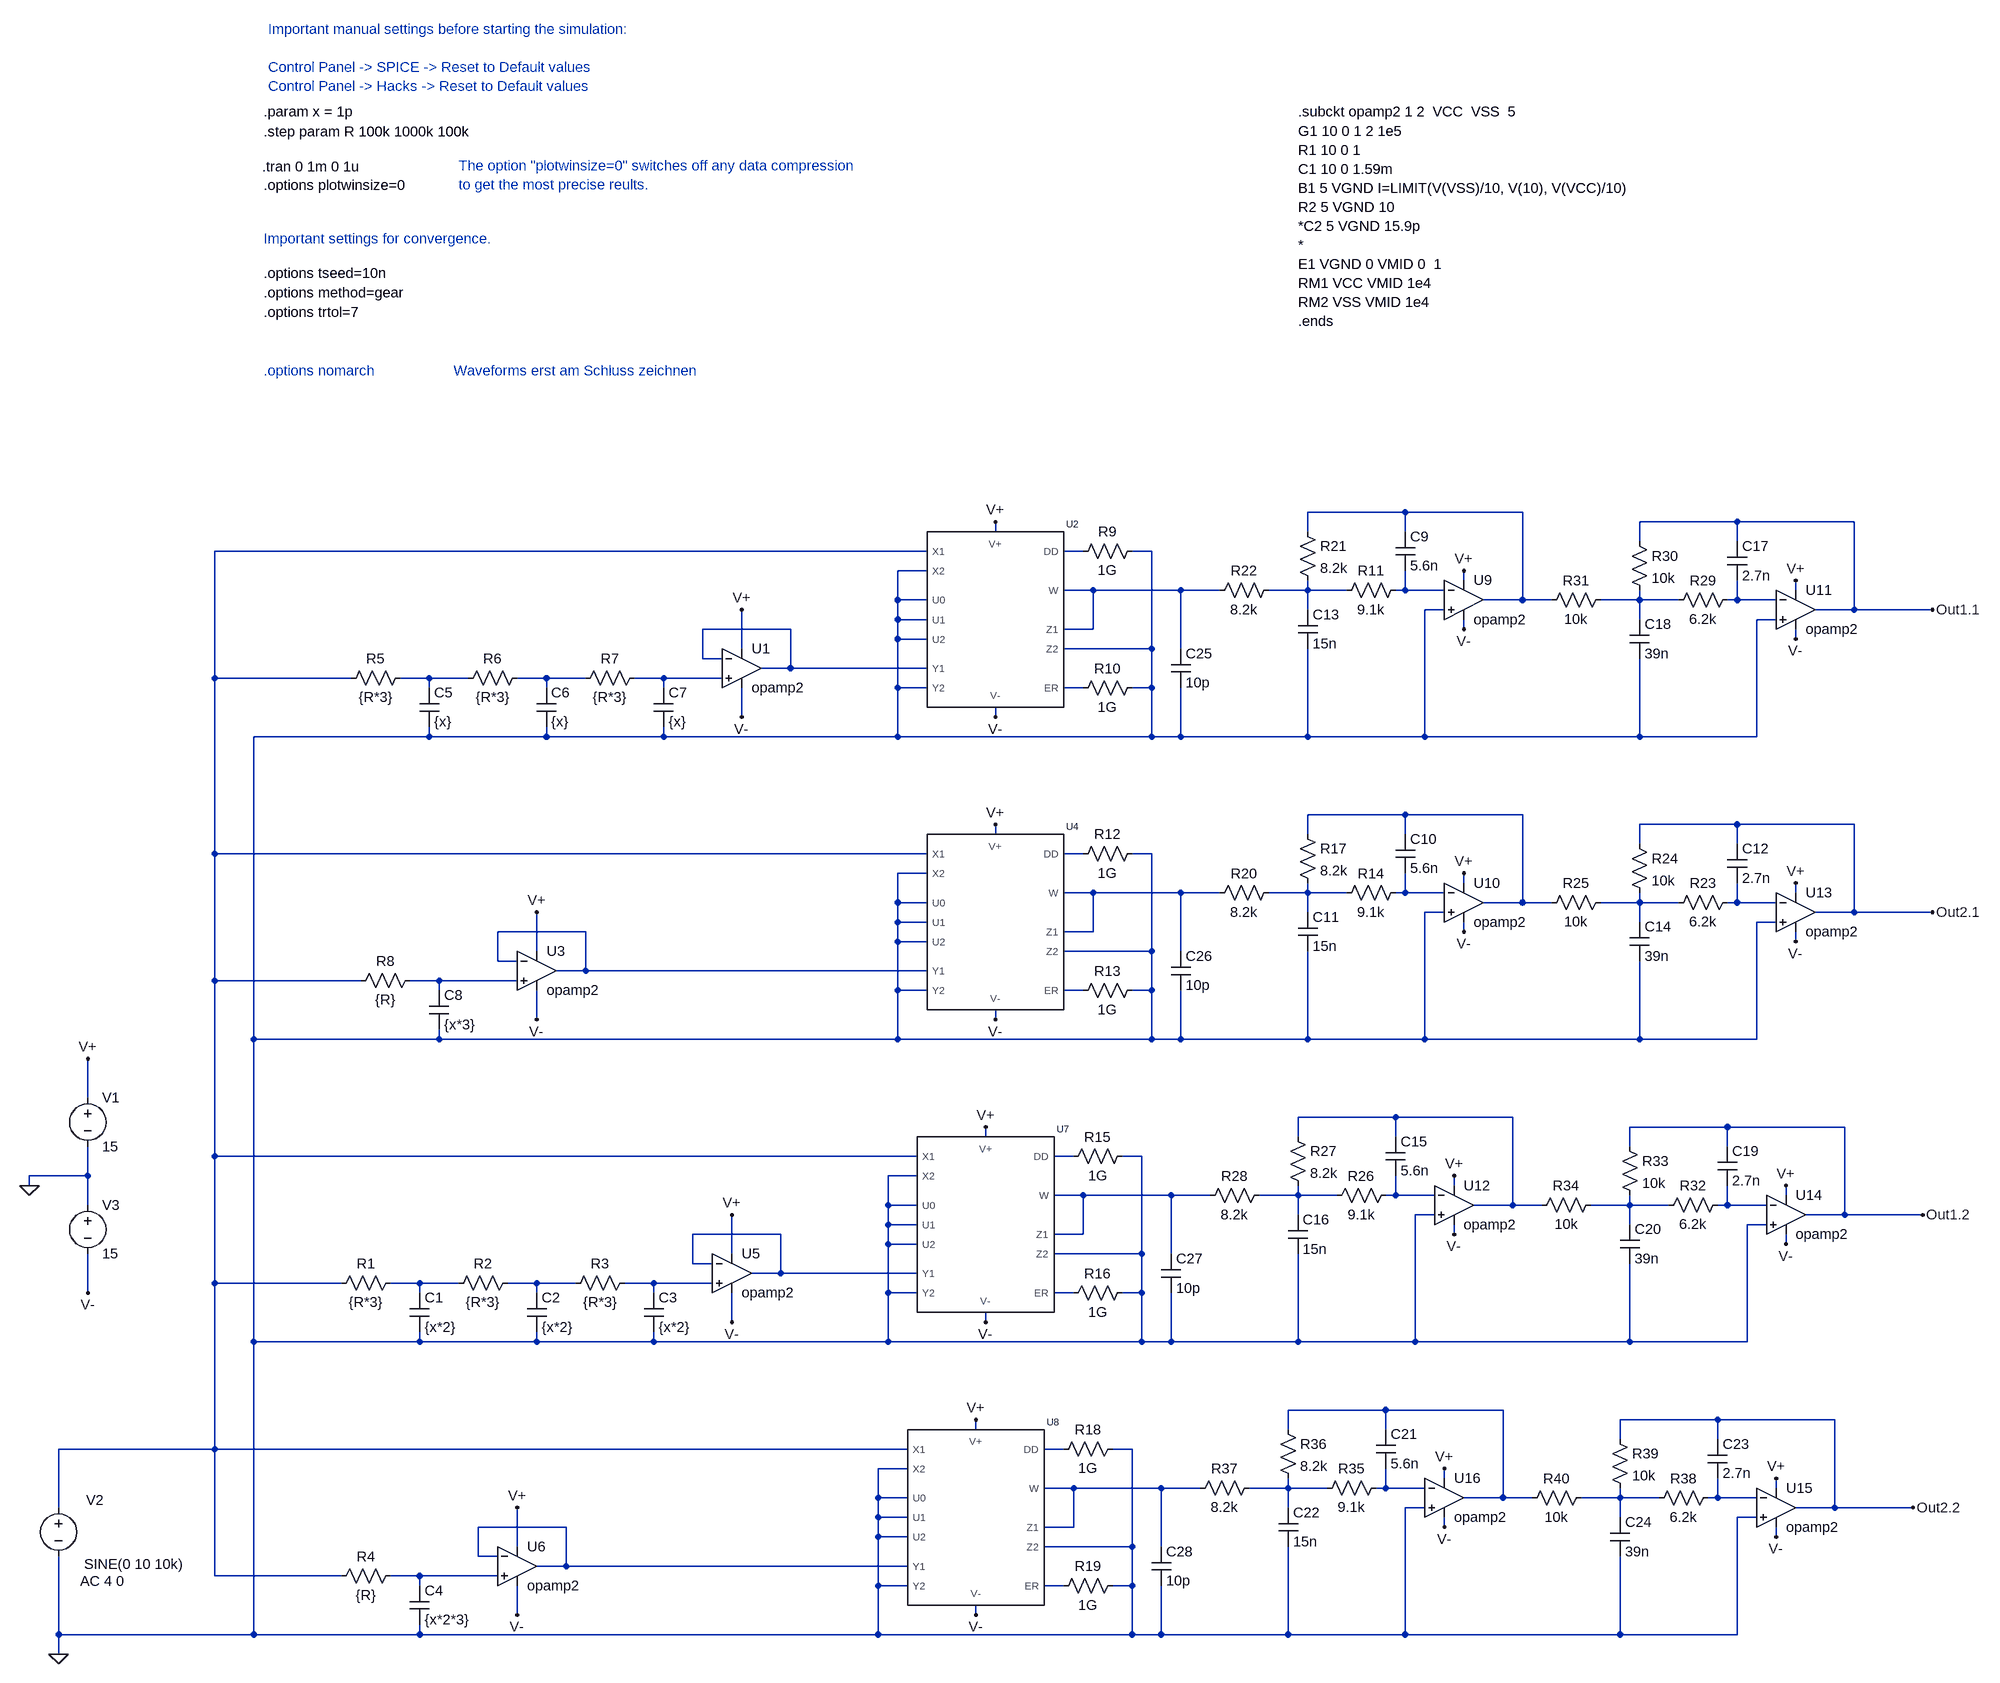
[diagram p0: schematic voll_leer_Kanal7_2.asc]
voll_leer_Kanal7_2.asc, the LTspice schematic file:
Version 4
SHEET 1 4732 680
WIRE -368 -176 -368 -192
WIRE -320 352 -320 256
WIRE -320 560 -320 432
WIRE -320 592 -320 560
WIRE -272 -320 -272 -384
WIRE -272 -192 -368 -192
WIRE -272 -192 -272 -240
WIRE -272 -144 -272 -192
WIRE -272 0 -272 -64
WIRE -64 -1008 -64 -1216
WIRE -64 -720 -64 -1008
WIRE -64 -512 -64 -720
WIRE -64 -224 -64 -512
WIRE -64 -16 -64 -224
WIRE -64 256 -320 256
WIRE -64 256 -64 -16
WIRE -64 464 -64 256
WIRE 0 -416 0 -912
WIRE 0 80 0 -416
WIRE 0 560 -320 560
WIRE 0 560 0 80
WIRE 144 -16 -64 -16
WIRE 144 464 -64 464
WIRE 160 -1008 -64 -1008
WIRE 176 -512 -64 -512
WIRE 272 -16 224 -16
WIRE 272 0 272 -16
WIRE 272 80 0 80
WIRE 272 80 272 64
WIRE 272 464 224 464
WIRE 272 480 272 464
WIRE 272 560 0 560
WIRE 272 560 272 544
WIRE 288 -1008 240 -1008
WIRE 288 -992 288 -1008
WIRE 288 -912 0 -912
WIRE 288 -912 288 -928
WIRE 304 -512 256 -512
WIRE 304 -496 304 -512
WIRE 304 -416 0 -416
WIRE 304 -416 304 -432
WIRE 336 -16 272 -16
WIRE 352 -1008 288 -1008
WIRE 368 432 368 384
WIRE 400 -544 400 -592
WIRE 400 432 368 432
WIRE 400 464 272 464
WIRE 432 -544 400 -544
WIRE 432 -512 304 -512
WIRE 432 416 432 352
WIRE 432 528 432 480
WIRE 464 -560 464 -624
WIRE 464 -448 464 -496
WIRE 464 -16 416 -16
WIRE 464 0 464 -16
WIRE 464 80 272 80
WIRE 464 80 464 64
WIRE 480 -1008 432 -1008
WIRE 480 -992 480 -1008
WIRE 480 -912 288 -912
WIRE 480 -912 480 -928
WIRE 512 384 368 384
WIRE 512 448 464 448
WIRE 512 448 512 384
WIRE 528 -16 464 -16
WIRE 544 -1008 480 -1008
WIRE 544 -592 400 -592
WIRE 544 -528 496 -528
WIRE 544 -528 544 -592
WIRE 656 -16 608 -16
WIRE 656 0 656 -16
WIRE 656 80 464 80
WIRE 656 80 656 64
WIRE 672 -1008 624 -1008
WIRE 672 -992 672 -1008
WIRE 672 -912 480 -912
WIRE 672 -912 672 -928
WIRE 720 -48 720 -96
WIRE 736 -1040 736 -1088
WIRE 752 -48 720 -48
WIRE 752 -16 656 -16
WIRE 768 -1040 736 -1040
WIRE 768 -1008 672 -1008
WIRE 784 -64 784 -128
WIRE 784 48 784 0
WIRE 800 -1056 800 -1120
WIRE 800 -944 800 -992
WIRE 864 -96 720 -96
WIRE 864 -32 816 -32
WIRE 864 -32 864 -96
WIRE 880 -1088 736 -1088
WIRE 880 -1024 832 -1024
WIRE 880 -1024 880 -1088
WIRE 1024 336 1024 288
WIRE 1024 368 1024 336
WIRE 1024 400 1024 368
WIRE 1024 480 1024 400
WIRE 1024 560 272 560
WIRE 1024 560 1024 480
WIRE 1040 -144 1040 -192
WIRE 1040 -112 1040 -144
WIRE 1040 -80 1040 -112
WIRE 1040 0 1040 -80
WIRE 1040 80 656 80
WIRE 1040 80 1040 0
WIRE 1056 -1136 1056 -1184
WIRE 1056 -1104 1056 -1136
WIRE 1056 -1072 1056 -1104
WIRE 1056 -992 1056 -1072
WIRE 1056 -912 672 -912
WIRE 1056 -912 1056 -992
WIRE 1056 -640 1056 -688
WIRE 1056 -608 1056 -640
WIRE 1056 -576 1056 -608
WIRE 1056 -496 1056 -576
WIRE 1056 -416 304 -416
WIRE 1056 -416 1056 -496
WIRE 1072 256 -64 256
WIRE 1072 288 1024 288
WIRE 1072 336 1024 336
WIRE 1072 368 1024 368
WIRE 1072 400 1024 400
WIRE 1072 448 512 448
WIRE 1072 480 1024 480
WIRE 1088 -224 -64 -224
WIRE 1088 -192 1040 -192
WIRE 1088 -144 1040 -144
WIRE 1088 -112 1040 -112
WIRE 1088 -80 1040 -80
WIRE 1088 -32 864 -32
WIRE 1088 0 1040 0
WIRE 1104 -1216 -64 -1216
WIRE 1104 -1184 1056 -1184
WIRE 1104 -1136 1056 -1136
WIRE 1104 -1104 1056 -1104
WIRE 1104 -1072 1056 -1072
WIRE 1104 -1024 880 -1024
WIRE 1104 -992 1056 -992
WIRE 1104 -720 -64 -720
WIRE 1104 -688 1056 -688
WIRE 1104 -640 1056 -640
WIRE 1104 -608 1056 -608
WIRE 1104 -576 1056 -576
WIRE 1104 -528 544 -528
WIRE 1104 -496 1056 -496
WIRE 1184 224 1184 208
WIRE 1184 528 1184 512
WIRE 1200 -256 1200 -272
WIRE 1200 48 1200 32
WIRE 1216 -1248 1216 -1264
WIRE 1216 -944 1216 -960
WIRE 1216 -752 1216 -768
WIRE 1216 -448 1216 -464
WIRE 1328 256 1296 256
WIRE 1328 480 1296 480
WIRE 1344 -224 1312 -224
WIRE 1344 0 1312 0
WIRE 1344 320 1296 320
WIRE 1344 384 1296 384
WIRE 1344 384 1344 320
WIRE 1360 -1216 1328 -1216
WIRE 1360 -992 1328 -992
WIRE 1360 -720 1328 -720
WIRE 1360 -496 1328 -496
WIRE 1360 -160 1312 -160
WIRE 1360 -96 1312 -96
WIRE 1360 -96 1360 -160
WIRE 1376 -1152 1328 -1152
WIRE 1376 -1088 1328 -1088
WIRE 1376 -1088 1376 -1152
WIRE 1376 -656 1328 -656
WIRE 1376 -592 1328 -592
WIRE 1376 -592 1376 -656
WIRE 1440 256 1408 256
WIRE 1440 416 1296 416
WIRE 1440 416 1440 256
WIRE 1440 480 1408 480
WIRE 1440 480 1440 416
WIRE 1440 560 1024 560
WIRE 1440 560 1440 480
WIRE 1456 -224 1424 -224
WIRE 1456 -64 1312 -64
WIRE 1456 -64 1456 -224
WIRE 1456 0 1424 0
WIRE 1456 0 1456 -64
WIRE 1456 80 1040 80
WIRE 1456 80 1456 0
WIRE 1472 -1216 1440 -1216
WIRE 1472 -1056 1328 -1056
WIRE 1472 -1056 1472 -1216
WIRE 1472 -992 1440 -992
WIRE 1472 -992 1472 -1056
WIRE 1472 -912 1056 -912
WIRE 1472 -912 1472 -992
WIRE 1472 -720 1440 -720
WIRE 1472 -560 1328 -560
WIRE 1472 -560 1472 -720
WIRE 1472 -496 1440 -496
WIRE 1472 -496 1472 -560
WIRE 1472 -416 1056 -416
WIRE 1472 -416 1472 -496
WIRE 1488 320 1344 320
WIRE 1488 416 1488 320
WIRE 1488 560 1440 560
WIRE 1488 560 1488 480
WIRE 1504 -160 1360 -160
WIRE 1504 -64 1504 -160
WIRE 1504 80 1456 80
WIRE 1504 80 1504 0
WIRE 1520 -1152 1376 -1152
WIRE 1520 -1056 1520 -1152
WIRE 1520 -912 1472 -912
WIRE 1520 -912 1520 -992
WIRE 1520 -656 1376 -656
WIRE 1520 -560 1520 -656
WIRE 1520 -416 1472 -416
WIRE 1520 -416 1520 -496
WIRE 1552 320 1488 320
WIRE 1568 -160 1504 -160
WIRE 1584 -1152 1520 -1152
WIRE 1584 -656 1520 -656
WIRE 1696 224 1696 192
WIRE 1696 320 1632 320
WIRE 1696 320 1696 304
WIRE 1696 352 1696 320
WIRE 1696 560 1488 560
WIRE 1696 560 1696 416
WIRE 1712 -256 1712 -288
WIRE 1712 -160 1648 -160
WIRE 1712 -160 1712 -176
WIRE 1712 -128 1712 -160
WIRE 1712 80 1504 80
WIRE 1712 80 1712 -64
WIRE 1728 -1248 1728 -1280
WIRE 1728 -1152 1664 -1152
WIRE 1728 -1152 1728 -1168
WIRE 1728 -1120 1728 -1152
WIRE 1728 -912 1520 -912
WIRE 1728 -912 1728 -1056
WIRE 1728 -752 1728 -784
WIRE 1728 -656 1664 -656
WIRE 1728 -656 1728 -672
WIRE 1728 -624 1728 -656
WIRE 1728 -416 1520 -416
WIRE 1728 -416 1728 -560
WIRE 1760 320 1696 320
WIRE 1776 -160 1712 -160
WIRE 1792 -1152 1728 -1152
WIRE 1792 -656 1728 -656
WIRE 1856 192 1696 192
WIRE 1856 224 1856 192
WIRE 1856 320 1840 320
WIRE 1856 320 1856 288
WIRE 1872 -288 1712 -288
WIRE 1872 -256 1872 -288
WIRE 1872 -160 1856 -160
WIRE 1872 -160 1872 -192
WIRE 1888 -1280 1728 -1280
WIRE 1888 -1248 1888 -1280
WIRE 1888 -1152 1872 -1152
WIRE 1888 -1152 1888 -1184
WIRE 1888 -784 1728 -784
WIRE 1888 -752 1888 -784
WIRE 1888 -656 1872 -656
WIRE 1888 -656 1888 -688
WIRE 1888 560 1696 560
WIRE 1888 560 1888 352
WIRE 1904 80 1712 80
WIRE 1904 80 1904 -128
WIRE 1920 -912 1728 -912
WIRE 1920 -912 1920 -1120
WIRE 1920 -416 1728 -416
WIRE 1920 -416 1920 -624
WIRE 1920 320 1856 320
WIRE 1920 352 1888 352
WIRE 1936 -160 1872 -160
WIRE 1936 -128 1904 -128
WIRE 1952 -1152 1888 -1152
WIRE 1952 -1120 1920 -1120
WIRE 1952 -656 1888 -656
WIRE 1952 -624 1920 -624
WIRE 1952 304 1952 288
WIRE 1952 384 1952 368
WIRE 1968 -176 1968 -192
WIRE 1968 -96 1968 -112
WIRE 1984 -1168 1984 -1184
WIRE 1984 -1088 1984 -1104
WIRE 1984 -672 1984 -688
WIRE 1984 -592 1984 -608
WIRE 2048 192 1856 192
WIRE 2048 336 1984 336
WIRE 2048 336 2048 192
WIRE 2064 -288 1872 -288
WIRE 2064 -144 2000 -144
WIRE 2064 -144 2064 -288
WIRE 2080 -1280 1888 -1280
WIRE 2080 -1136 2016 -1136
WIRE 2080 -1136 2080 -1280
WIRE 2080 -784 1888 -784
WIRE 2080 -640 2016 -640
WIRE 2080 -640 2080 -784
WIRE 2096 336 2048 336
WIRE 2112 -144 2064 -144
WIRE 2128 -1136 2080 -1136
WIRE 2128 -640 2080 -640
WIRE 2240 240 2240 208
WIRE 2240 336 2176 336
WIRE 2240 336 2240 320
WIRE 2240 368 2240 336
WIRE 2240 560 1888 560
WIRE 2240 560 2240 432
WIRE 2256 -240 2256 -272
WIRE 2256 -144 2192 -144
WIRE 2256 -144 2256 -160
WIRE 2256 -112 2256 -144
WIRE 2256 80 1904 80
WIRE 2256 80 2256 -48
WIRE 2272 -1232 2272 -1264
WIRE 2272 -1136 2208 -1136
WIRE 2272 -1136 2272 -1152
WIRE 2272 -1104 2272 -1136
WIRE 2272 -912 1920 -912
WIRE 2272 -912 2272 -1040
WIRE 2272 -736 2272 -768
WIRE 2272 -640 2208 -640
WIRE 2272 -640 2272 -656
WIRE 2272 -608 2272 -640
WIRE 2272 -416 1920 -416
WIRE 2272 -416 2272 -544
WIRE 2304 336 2240 336
WIRE 2320 -144 2256 -144
WIRE 2336 -1136 2272 -1136
WIRE 2336 -640 2272 -640
WIRE 2400 208 2240 208
WIRE 2400 240 2400 208
WIRE 2400 336 2384 336
WIRE 2400 336 2400 304
WIRE 2416 -272 2256 -272
WIRE 2416 -240 2416 -272
WIRE 2416 -144 2400 -144
WIRE 2416 -144 2416 -176
WIRE 2432 -1264 2272 -1264
WIRE 2432 -1232 2432 -1264
WIRE 2432 -1136 2416 -1136
WIRE 2432 -1136 2432 -1168
WIRE 2432 -768 2272 -768
WIRE 2432 -736 2432 -768
WIRE 2432 -640 2416 -640
WIRE 2432 -640 2432 -672
WIRE 2432 560 2240 560
WIRE 2432 560 2432 368
WIRE 2448 80 2256 80
WIRE 2448 80 2448 -112
WIRE 2464 -912 2272 -912
WIRE 2464 -912 2464 -1104
WIRE 2464 -416 2272 -416
WIRE 2464 -416 2464 -608
WIRE 2464 336 2400 336
WIRE 2464 368 2432 368
WIRE 2480 -144 2416 -144
WIRE 2480 -112 2448 -112
WIRE 2496 -1136 2432 -1136
WIRE 2496 -1104 2464 -1104
WIRE 2496 -640 2432 -640
WIRE 2496 -608 2464 -608
WIRE 2496 320 2496 304
WIRE 2496 400 2496 384
WIRE 2512 -160 2512 -176
WIRE 2512 -80 2512 -96
WIRE 2528 -1152 2528 -1168
WIRE 2528 -1072 2528 -1088
WIRE 2528 -656 2528 -672
WIRE 2528 -576 2528 -592
WIRE 2592 208 2400 208
WIRE 2592 352 2528 352
WIRE 2592 352 2592 208
WIRE 2608 -272 2416 -272
WIRE 2608 -128 2544 -128
WIRE 2608 -128 2608 -272
WIRE 2624 -1264 2432 -1264
WIRE 2624 -1120 2560 -1120
WIRE 2624 -1120 2624 -1264
WIRE 2624 -768 2432 -768
WIRE 2624 -624 2560 -624
WIRE 2624 -624 2624 -768
WIRE 2720 352 2592 352
WIRE 2736 -128 2608 -128
WIRE 2752 -1120 2624 -1120
WIRE 2752 -624 2624 -624
FLAG -320 592 0
FLAG -368 -176 0
FLAG -272 0 V-
FLAG -272 -384 V+
FLAG 800 -1120 V+
FLAG 800 -944 V-
FLAG 464 -624 V+
FLAG 464 -448 V-
FLAG 1216 -1264 V+
FLAG 1216 -944 V-
FLAG 2752 -1120 Out1.1
FLAG 1216 -768 V+
FLAG 1216 -448 V-
FLAG 784 -128 V+
FLAG 784 48 V-
FLAG 1200 -272 V+
FLAG 1200 48 V-
FLAG 432 352 V+
FLAG 432 528 V-
FLAG 1184 208 V+
FLAG 1184 528 V-
FLAG 1984 -1184 V+
FLAG 1984 -1088 V-
FLAG 2528 -1168 V+
FLAG 2528 -1072 V-
FLAG 2752 -624 Out2.1
FLAG 1984 -688 V+
FLAG 1984 -592 V-
FLAG 2528 -672 V+
FLAG 2528 -576 V-
FLAG 2736 -128 Out1.2
FLAG 1968 -192 V+
FLAG 1968 -96 V-
FLAG 2512 -176 V+
FLAG 2512 -80 V-
FLAG 2720 352 Out2.2
FLAG 1952 288 V+
FLAG 1952 384 V-
FLAG 2496 304 V+
FLAG 2496 400 V-
SYMBOL res 256 -1024 R90
WINDOW 0 0 56 VBottom 0
WINDOW 3 32 56 VTop 0
SYMATTR InstName R5
SYMATTR Value {R*3}
SYMBOL cap 272 -992 R0
SYMATTR InstName C5
SYMATTR Value {x}
SYMBOL res 448 -1024 R90
WINDOW 0 0 56 VBottom 0
WINDOW 3 32 56 VTop 0
SYMATTR InstName R6
SYMATTR Value {R*3}
SYMBOL cap 464 -992 R0
SYMATTR InstName C6
SYMATTR Value {x}
SYMBOL res 640 -1024 R90
WINDOW 0 0 56 VBottom 0
WINDOW 3 32 56 VTop 0
SYMATTR InstName R7
SYMATTR Value {R*3}
SYMBOL cap 656 -992 R0
SYMATTR InstName C7
SYMATTR Value {x}
SYMBOL voltage -320 336 M0
WINDOW 123 -109 137 Left 0
WINDOW 39 0 0 Left 0
WINDOW 0 -75 4 Left 0
WINDOW 3 -207 109 Left 0
SYMATTR Value2 AC 4 0
SYMATTR InstName V2
SYMATTR Value SINE(0 10 10k)
SYMBOL res 272 -528 R90
WINDOW 0 0 56 VBottom 0
WINDOW 3 32 56 VTop 0
SYMATTR InstName R8
SYMATTR Value {R}
SYMBOL cap 288 -496 R0
SYMATTR InstName C8
SYMATTR Value {x*3}
SYMBOL voltage -272 -336 R0
WINDOW 123 0 0 Left 0
WINDOW 39 24 44 Left 0
SYMATTR InstName V1
SYMATTR Value 15
SYMBOL voltage -272 -160 R0
WINDOW 123 0 0 Left 0
WINDOW 39 24 44 Left 0
SYMATTR InstName V3
SYMATTR Value 15
SYMBOL ad734 1216 -1120 R0
SYMATTR Value AD734.bin
SYMATTR SpiceLine AD734
SYMATTR InstName U2
SYMBOL res 1456 -1232 R90
WINDOW 0 0 56 VBottom 0
WINDOW 3 32 56 VTop 0
SYMATTR InstName R9
SYMATTR Value 1G
SYMBOL res 1456 -1008 R90
WINDOW 0 0 56 VBottom 0
WINDOW 3 32 56 VTop 0
SYMATTR InstName R10
SYMATTR Value 1G
SYMBOL ad734 1216 -624 R0
SYMATTR Value AD734.bin
SYMATTR SpiceLine AD734
SYMATTR InstName U4
SYMBOL res 1456 -736 R90
WINDOW 0 0 56 VBottom 0
WINDOW 3 32 56 VTop 0
SYMATTR InstName R12
SYMATTR Value 1G
SYMBOL res 1456 -512 R90
WINDOW 0 0 56 VBottom 0
WINDOW 3 32 56 VTop 0
SYMATTR InstName R13
SYMATTR Value 1G
SYMBOL res 240 -32 R90
WINDOW 0 0 56 VBottom 0
WINDOW 3 32 56 VTop 0
SYMATTR InstName R1
SYMATTR Value {R*3}
SYMBOL cap 256 0 R0
SYMATTR InstName C1
SYMATTR Value {x*2}
SYMBOL res 432 -32 R90
WINDOW 0 0 56 VBottom 0
WINDOW 3 32 56 VTop 0
SYMATTR InstName R2
SYMATTR Value {R*3}
SYMBOL cap 448 0 R0
SYMATTR InstName C2
SYMATTR Value {x*2}
SYMBOL res 624 -32 R90
WINDOW 0 0 56 VBottom 0
WINDOW 3 32 56 VTop 0
SYMATTR InstName R3
SYMATTR Value {R*3}
SYMBOL cap 640 0 R0
SYMATTR InstName C3
SYMATTR Value {x*2}
SYMBOL ad734 1200 -128 R0
SYMATTR Value AD734.bin
SYMATTR SpiceLine AD734
SYMATTR InstName U7
SYMBOL res 1440 -240 R90
WINDOW 0 0 56 VBottom 0
WINDOW 3 32 56 VTop 0
SYMATTR InstName R15
SYMATTR Value 1G
SYMBOL res 1440 -16 R90
WINDOW 0 0 56 VBottom 0
WINDOW 3 32 56 VTop 0
SYMATTR InstName R16
SYMATTR Value 1G
SYMBOL res 240 448 R90
WINDOW 0 0 56 VBottom 0
WINDOW 3 32 56 VTop 0
SYMATTR InstName R4
SYMATTR Value {R}
SYMBOL cap 256 480 R0
SYMATTR InstName C4
SYMATTR Value {x*2*3}
SYMBOL ad734 1184 352 R0
SYMATTR Value AD734.bin
SYMATTR SpiceLine AD734
SYMATTR InstName U8
SYMBOL res 1424 240 R90
WINDOW 0 0 56 VBottom 0
WINDOW 3 32 56 VTop 0
SYMATTR InstName R18
SYMATTR Value 1G
SYMBOL res 1424 464 R90
WINDOW 0 0 56 VBottom 0
WINDOW 3 32 56 VTop 0
SYMATTR InstName R19
SYMATTR Value 1G
SYMBOL res 1888 -1168 R90
WINDOW 0 0 56 VBottom 0
WINDOW 3 32 56 VTop 0
SYMATTR InstName R11
SYMATTR Value 9.1k
SYMBOL cap 1872 -1248 R0
SYMATTR InstName C9
SYMATTR Value 5.6n
SYMBOL res 1712 -1264 R0
SYMATTR InstName R21
SYMATTR Value 8.2k
SYMBOL res 1680 -1168 R90
WINDOW 0 0 56 VBottom 0
WINDOW 3 32 56 VTop 0
SYMATTR InstName R22
SYMATTR Value 8.2k
SYMBOL cap 1712 -1120 R0
SYMATTR InstName C13
SYMATTR Value 15n
SYMBOL res 2432 -1152 R90
WINDOW 0 0 56 VBottom 0
WINDOW 3 32 56 VTop 0
SYMATTR InstName R29
SYMATTR Value 6.2k
SYMBOL cap 2416 -1232 R0
SYMATTR InstName C17
SYMATTR Value 2.7n
SYMBOL res 2256 -1248 R0
SYMATTR InstName R30
SYMATTR Value 10k
SYMBOL res 2224 -1152 R90
WINDOW 0 0 56 VBottom 0
WINDOW 3 32 56 VTop 0
SYMATTR InstName R31
SYMATTR Value 10k
SYMBOL cap 2256 -1104 R0
SYMATTR InstName C18
SYMATTR Value 39n
SYMBOL res 1888 -672 R90
WINDOW 0 0 56 VBottom 0
WINDOW 3 32 56 VTop 0
SYMATTR InstName R14
SYMATTR Value 9.1k
SYMBOL cap 1872 -752 R0
SYMATTR InstName C10
SYMATTR Value 5.6n
SYMBOL res 1712 -768 R0
SYMATTR InstName R17
SYMATTR Value 8.2k
SYMBOL res 1680 -672 R90
WINDOW 0 0 56 VBottom 0
WINDOW 3 32 56 VTop 0
SYMATTR InstName R20
SYMATTR Value 8.2k
SYMBOL cap 1712 -624 R0
SYMATTR InstName C11
SYMATTR Value 15n
SYMBOL res 2432 -656 R90
WINDOW 0 0 56 VBottom 0
WINDOW 3 32 56 VTop 0
SYMATTR InstName R23
SYMATTR Value 6.2k
SYMBOL cap 2416 -736 R0
SYMATTR InstName C12
SYMATTR Value 2.7n
SYMBOL res 2256 -752 R0
SYMATTR InstName R24
SYMATTR Value 10k
SYMBOL res 2224 -656 R90
WINDOW 0 0 56 VBottom 0
WINDOW 3 32 56 VTop 0
SYMATTR InstName R25
SYMATTR Value 10k
SYMBOL cap 2256 -608 R0
SYMATTR InstName C14
SYMATTR Value 39n
SYMBOL res 1872 -176 R90
WINDOW 0 0 56 VBottom 0
WINDOW 3 32 56 VTop 0
SYMATTR InstName R26
SYMATTR Value 9.1k
SYMBOL cap 1856 -256 R0
SYMATTR InstName C15
SYMATTR Value 5.6n
SYMBOL res 1696 -272 R0
SYMATTR InstName R27
SYMATTR Value 8.2k
SYMBOL res 1664 -176 R90
WINDOW 0 0 56 VBottom 0
WINDOW 3 32 56 VTop 0
SYMATTR InstName R28
SYMATTR Value 8.2k
SYMBOL cap 1696 -128 R0
SYMATTR InstName C16
SYMATTR Value 15n
SYMBOL res 2416 -160 R90
WINDOW 0 0 56 VBottom 0
WINDOW 3 32 56 VTop 0
SYMATTR InstName R32
SYMATTR Value 6.2k
SYMBOL cap 2400 -240 R0
SYMATTR InstName C19
SYMATTR Value 2.7n
SYMBOL res 2240 -256 R0
SYMATTR InstName R33
SYMATTR Value 10k
SYMBOL res 2208 -160 R90
WINDOW 0 0 56 VBottom 0
WINDOW 3 32 56 VTop 0
SYMATTR InstName R34
SYMATTR Value 10k
SYMBOL cap 2240 -112 R0
SYMATTR InstName C20
SYMATTR Value 39n
SYMBOL res 1856 304 R90
WINDOW 0 0 56 VBottom 0
WINDOW 3 32 56 VTop 0
SYMATTR InstName R35
SYMATTR Value 9.1k
SYMBOL cap 1840 224 R0
SYMATTR InstName C21
SYMATTR Value 5.6n
SYMBOL res 1680 208 R0
SYMATTR InstName R36
SYMATTR Value 8.2k
SYMBOL res 1648 304 R90
WINDOW 0 0 56 VBottom 0
WINDOW 3 32 56 VTop 0
SYMATTR InstName R37
SYMATTR Value 8.2k
SYMBOL cap 1680 352 R0
SYMATTR InstName C22
SYMATTR Value 15n
SYMBOL res 2400 320 R90
WINDOW 0 0 56 VBottom 0
WINDOW 3 32 56 VTop 0
SYMATTR InstName R38
SYMATTR Value 6.2k
SYMBOL cap 2384 240 R0
SYMATTR InstName C23
SYMATTR Value 2.7n
SYMBOL res 2224 224 R0
SYMATTR InstName R39
SYMATTR Value 10k
SYMBOL res 2192 320 R90
WINDOW 0 0 56 VBottom 0
WINDOW 3 32 56 VTop 0
SYMATTR InstName R40
SYMATTR Value 10k
SYMBOL cap 2224 368 R0
SYMATTR InstName C24
SYMATTR Value 39n
SYMBOL Opamps\\opamp2 800 -1088 R0
SYMATTR InstName U1
SYMBOL Opamps\\opamp2 464 -592 R0
SYMATTR InstName U3
SYMBOL Opamps\\opamp2 784 -96 R0
SYMATTR InstName U5
SYMBOL Opamps\\opamp2 432 384 R0
SYMATTR InstName U6
SYMBOL Opamps\\opamp2 1984 -1200 R0
SYMATTR InstName U9
SYMBOL Opamps\\opamp2 1984 -704 R0
SYMATTR InstName U10
SYMBOL Opamps\\opamp2 1968 -208 R0
SYMATTR InstName U12
SYMBOL Opamps\\opamp2 2528 -1184 R0
SYMATTR InstName U11
SYMBOL Opamps\\opamp2 2528 -688 R0
SYMATTR InstName U13
SYMBOL Opamps\\opamp2 2512 -192 R0
SYMATTR InstName U14
SYMBOL Opamps\\opamp2 2496 288 R0
SYMATTR InstName U15
SYMBOL Opamps\\opamp2 1952 272 R0
SYMATTR InstName U16
SYMBOL cap 1504 -1056 R0
SYMATTR InstName C25
SYMATTR Value 10p
SYMBOL cap 1504 -560 R0
SYMATTR InstName C26
SYMATTR Value 10p
SYMBOL cap 1488 -64 R0
SYMATTR InstName C27
SYMATTR Value 10p
SYMBOL cap 1472 416 R0
SYMATTR InstName C28
SYMATTR Value 10p
TEXT 16 -1904 Left 0 !.step param R 100k 1000k 100k
TEXT 16 -1512 Left 0 ;.options nomarch
TEXT 14 -1846 Left 0 !.tran 0 1m 0 1u
TEXT 16 -1672 Left 0 !.options tseed=10n
TEXT 16 -1816 Left 0 !.options plotwinsize=0
TEXT 336 -1848 Left 0 ;The option "plotwinsize=0" switches off any data compression \nto get the most precise reults.
TEXT 24 -2072 Left 0 ;Important manual settings before starting the simulation:\n \nControl Panel -> SPICE -> Reset to Default values\nControl Panel -> Hacks -> Reset to Default values
TEXT 16 -1640 Left 0 !.options method=gear
TEXT 16 -1728 Left 0 ;Important settings for convergence.
TEXT 328 -1512 Left 0 ;Waveforms erst am Schluss zeichnen
TEXT 16 -1936 Left 0 !.param x = 1p
TEXT 1712 -1936 Left 0 !.subckt opamp2 1 2  VCC  VSS  5\nG1 10 0 1 2 1e5\nR1 10 0 1\nC1 10 0 1.59m\nB1 5 VGND I=LIMIT(V(VSS)/10, V(10), V(VCC)/10)\nR2 5 VGND 10\n*C2 5 VGND 15.9p\n*\nE1 VGND 0 VMID 0  1\nRM1 VCC VMID 1e4\nRM2 VSS VMID 1e4\n.ends
TEXT 16 -1608 Left 0 !.options trtol=7

The netlist it stands for:
* voll_leer_Kanal7_2.asc
R5 N004 N001 {R*3}
C5 N004 0 {x}
R6 N009 N004 {R*3}
C6 N009 0 {x}
R7 N011 N009 {R*3}
C7 N011 0 {x}
V2 N001 0 SINE(0 10 10k) AC 4 0
R8 N005 N001 {R}
C8 N005 0 {x*3}
V1 V+ 0 15
V3 0 V- 15
XU2 N001 0 0 0 0 N013 0 V- N020 0 N024 N024 N019 V+ AD734 AD734  ; pins X1 X2 U0 U1 U2 Y1 Y2 V- ER Z2 Z1 W DD V+
R9 0 N019 1G
R10 0 N020 1G
XU4 N001 0 0 0 0 N007 0 V- N022 0 N025 N025 N021 V+ AD734 AD734  ; pins X1 X2 U0 U1 U2 Y1 Y2 V- ER Z2 Z1 W DD V+
R12 0 N021 1G
R13 0 N022 1G
R1 N002 N001 {R*3}
C1 N002 0 {x*2}
R2 N008 N002 {R*3}
C2 N008 0 {x*2}
R3 N010 N008 {R*3}
C3 N010 0 {x*2}
XU7 N001 0 0 0 0 N012 0 V- N017 0 N023 N023 N016 V+ AD734 AD734  ; pins X1 X2 U0 U1 U2 Y1 Y2 V- ER Z2 Z1 W DD V+
R15 0 N016 1G
R16 0 N017 1G
R4 N003 N001 {R}
C4 N003 0 {x*2*3}
XU8 N001 0 0 0 0 N006 0 V- N015 0 N018 N018 N014 V+ AD734 AD734  ; pins X1 X2 U0 U1 U2 Y1 Y2 V- ER Z2 Z1 W DD V+
R18 0 N014 1G
R19 0 N015 1G
R11 N036 N031 9.1k
C9 N030 N036 5.6n
R21 N030 N031 8.2k
R22 N031 N024 8.2k
C13 N031 0 15n
R29 N044 N040 6.2k
C17 Out1.1 N044 2.7n
R30 Out1.1 N040 10k
R31 N040 N030 10k
C18 N040 0 39n
R14 N037 N033 9.1k
C10 N032 N037 5.6n
R17 N032 N033 8.2k
R20 N033 N025 8.2k
C11 N033 0 15n
R23 N045 N041 6.2k
C12 Out2.1 N045 2.7n
R24 Out2.1 N041 10k
R25 N041 N032 10k
C14 N041 0 39n
R26 N035 N029 9.1k
C15 N028 N035 5.6n
R27 N028 N029 8.2k
R28 N029 N023 8.2k
C16 N029 0 15n
R32 N043 N039 6.2k
C19 Out1.2 N043 2.7n
R33 Out1.2 N039 10k
R34 N039 N028 10k
C20 N039 0 39n
R35 N034 N027 9.1k
C21 N026 N034 5.6n
R36 N026 N027 8.2k
R37 N027 N018 8.2k
C22 N027 0 15n
R38 N042 N038 6.2k
C23 Out2.2 N042 2.7n
R39 Out2.2 N038 10k
R40 N038 N026 10k
C24 N038 0 39n
XU1 N011 N013 V+ V- N013 opamp2  ; pins In+ In- V+ V- OUT
XU3 N005 N007 V+ V- N007 opamp2  ; pins In+ In- V+ V- OUT
XU5 N010 N012 V+ V- N012 opamp2  ; pins In+ In- V+ V- OUT
XU6 N003 N006 V+ V- N006 opamp2  ; pins In+ In- V+ V- OUT
XU9 0 N036 V+ V- N030 opamp2  ; pins In+ In- V+ V- OUT
XU10 0 N037 V+ V- N032 opamp2  ; pins In+ In- V+ V- OUT
XU12 0 N035 V+ V- N028 opamp2  ; pins In+ In- V+ V- OUT
XU11 0 N044 V+ V- Out1.1 opamp2  ; pins In+ In- V+ V- OUT
XU13 0 N045 V+ V- Out2.1 opamp2  ; pins In+ In- V+ V- OUT
XU14 0 N043 V+ V- Out1.2 opamp2  ; pins In+ In- V+ V- OUT
XU15 0 N042 V+ V- Out2.2 opamp2  ; pins In+ In- V+ V- OUT
XU16 0 N034 V+ V- N026 opamp2  ; pins In+ In- V+ V- OUT
C25 N024 0 10p
C26 N025 0 10p
C27 N023 0 10p
C28 N018 0 10p
.step param R 100k 1000k 100k
* .options nomarch
.tran 0 1m 0 1u
.options tseed=10n
.options plotwinsize=0
* The option "plotwinsize=0" switches off any data compression
* to get the most precise reults.
* Important manual settings before starting the simulation:
* Control Panel -> SPICE -> Reset to Default values
* Control Panel -> Hacks -> Reset to Default values
.options method=gear
* Important settings for convergence.
* Waveforms erst am Schluss zeichnen
.param x = 1p
.subckt opamp2 1 2  VCC  VSS  5
G1 10 0 1 2 1e5
R1 10 0 1
C1 10 0 1.59m
B1 5 VGND I=LIMIT(V(VSS)/10, V(10), V(VCC)/10)
R2 5 VGND 10
*C2 5 VGND 15.9p
*
E1 VGND 0 VMID 0  1
RM1 VCC VMID 1e4
RM2 VSS VMID 1e4
.ends
.options trtol=7
.lib AD734.sub
.backanno
.end